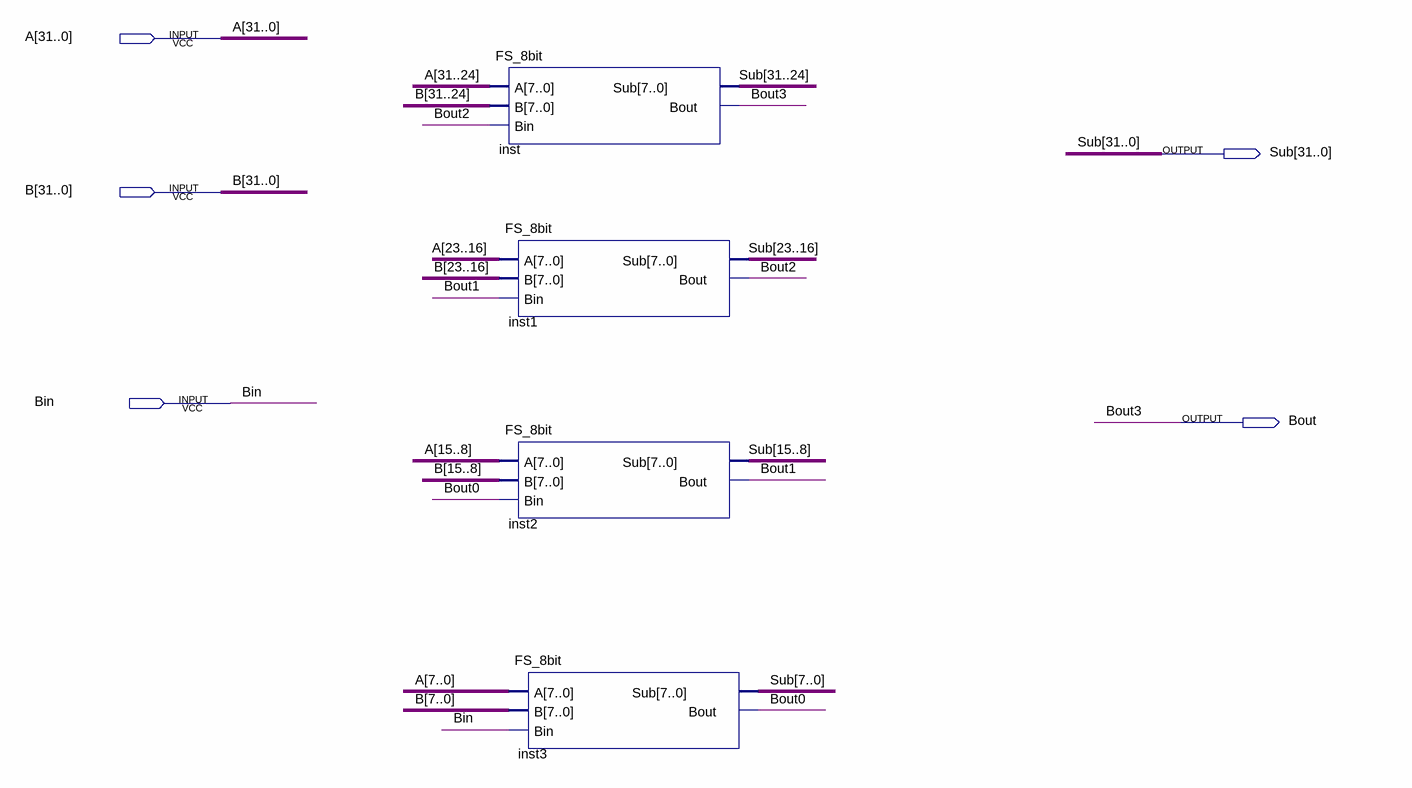
[diagram p0: schematic sheet]
// Quartus schematic FS_32bit.bdf as structural Verilog: 4 symbols, 5 pins
module FS_32bit (
  input  [31:0] A,
  input  [31:0] B,
  input  Bin,
  output [31:0] Sub,
  output Bout
);

  wire Bout0, Bout1, Bout2;

  FS_8bit inst (.A(A[31:24]), .B(B[31:24]), .Bin(Bout2), .Sub(Sub[31:24]), .Bout(Bout));
  FS_8bit inst1 (.A(A[23:16]), .B(B[23:16]), .Bin(Bout1), .Sub(Sub[23:16]), .Bout(Bout2));
  FS_8bit inst2 (.A(A[15:8]), .B(B[15:8]), .Bin(Bout0), .Sub(Sub[15:8]), .Bout(Bout1));
  FS_8bit inst3 (.A(A[7:0]), .B(B[7:0]), .Bin(Bin), .Sub(Sub[7:0]), .Bout(Bout0));

  // Other names for the same wires on the sheet: Bout3 = Bout
endmodule
